# Altium schematic sheet EV2760-VT-00A.SchDoc: T-EV2760-V-03A
size A4; Organization: MPS; Revision: 03A; Checker: XXXX; Drawer: Alen Du; PageSetup: Record=PageOptions|CenterHorizontal=True|CenterVertical=True|PrintScale=1.00|XCorrection=1.00|YCorrection=1.00|PrintKind=0|BorderSize=5000000|LeftOffset=0|BottomOffset=0|Orientation=2|PaperLength=1000|PaperWidth=1000|Scale=100|PaperSource=15|PrintQuality=1200|MediaType=1|DitherType=10|PaperKind=A4|PrintScaleMode=1
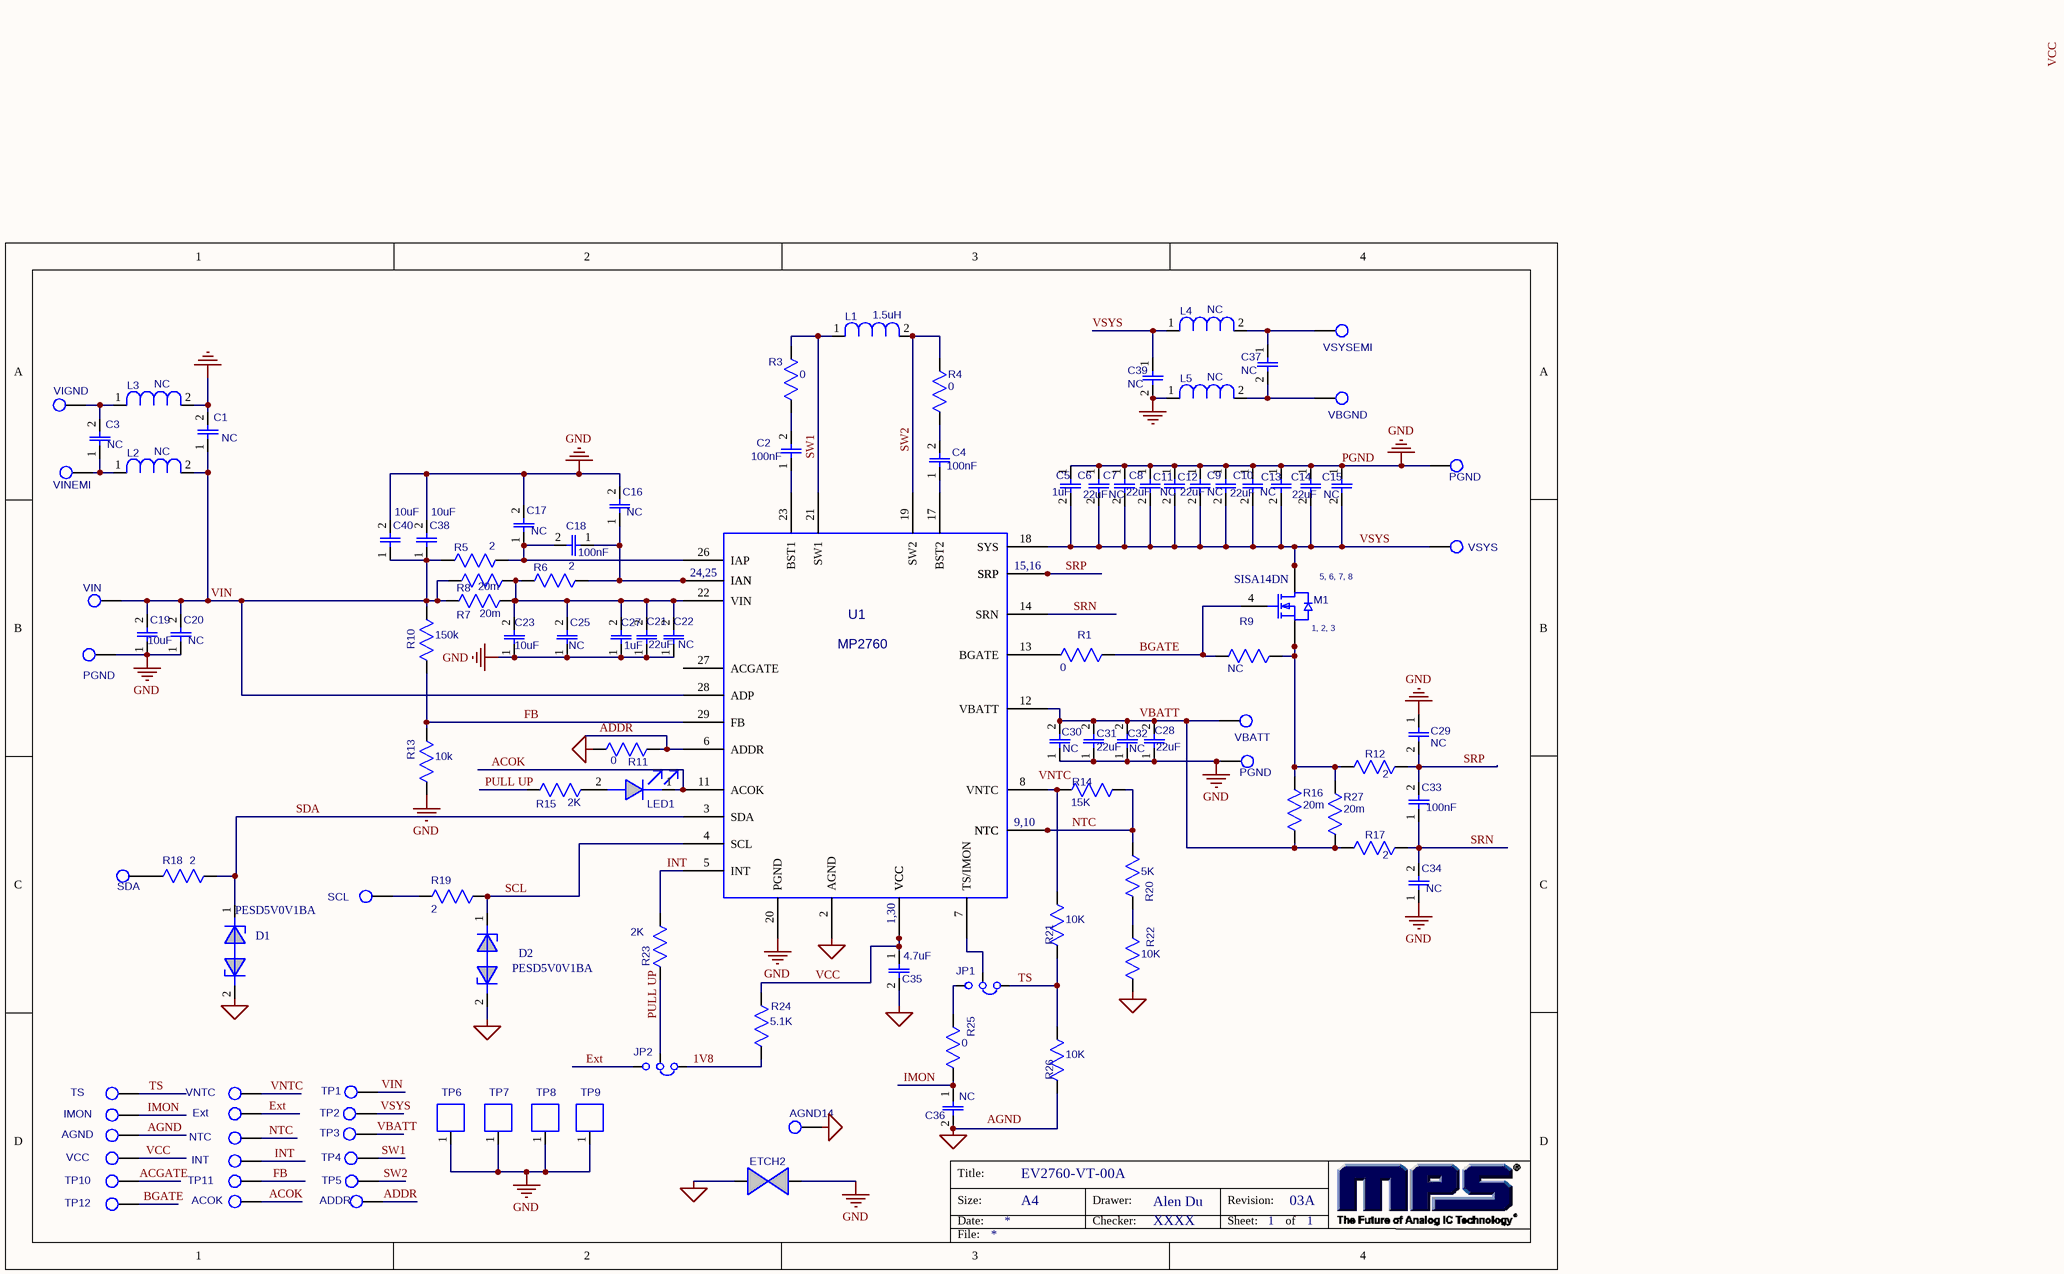
[diagram p0: EV2760-VT-00A.SchDoc]

## Parts
ACOK  {Package}  [CONN/TP]  (value not drawn)
ADDR  {Package}  [CONN/TP]  (value not drawn)
AGND  {Package}  [CONN/TP]  (value not drawn)
AGND14  {Package}  [CONN/TP]  (value not drawn)
C1  value NC  [CAP/0805]  (hidden comment: CAP/0603)
C2  value 100nF  [CAP/0603]  (hidden comment: CAP/0603)
C3  value NC  [CAP/0805]  (hidden comment: CAP/0603)
C4  value 100nF  [CAP/0603]  (hidden comment: CAP/0603)
C5  value 1uF  [CAP/0603]  (hidden comment: CAP/0402)
C6  value 22uF  [CAP/0805]  (hidden comment: CAP/0805)
C7  value NC  [CAP/0805]  (hidden comment: CAP/0805)
C8  value 22uF  [CAP/0805]  (hidden comment: CAP/0805)
C9  value NC  [CAP/0805]  (hidden comment: CAP/0805)
C10  value 22uF  [CAP/0805]  (hidden comment: CAP/0805)
C11  value NC  [CAP/0805]  (hidden comment: CAP/0805)
C12  value 22uF  [CAP/0805]  (hidden comment: CAP/0805)
C13  value NC  [CAP/0805]  (hidden comment: CAP/0805)
C14  value 22uF  [CAP/0805]  (hidden comment: 0805)
C15  value NC  [CAP/0603]  (hidden comment: CAP/0603)
C16  value NC  [CAP/0603]  (hidden comment: CAP/0603)
C17  value NC  [CAP/0603]  (hidden comment: CAP/0603)
C18  value 100nF  [CAP/0603]  (hidden comment: CAP/0603)
C19  value 10uF  [CAP/0805]  (hidden comment: CAP/0805)
C20  value NC  [CAP/0805]  (hidden comment: CAP/0805)
C21  value 22uF  [CAP/0603]  (hidden comment: CAP/0805)
C22  value NC  [CAP/0603]  (hidden comment: CAP/0603)
C23  value 10uF  [CAP/0805]  (hidden comment: CAP/0805)
C25  value NC  [CAP/0805]  (hidden comment: CAP/0805)
C27  value 1uF  [CAP/0603]  (hidden comment: CAP/0402)
C28  value 22uF  [CAP/0805]  (hidden comment: CAP/0805)
C29  value NC  [CAP/0603]  (hidden comment: CAP/0603)
C30  value NC  [CAP/0805]  (hidden comment: CAP/0805)
C31  value 22uF  [CAP/0805]  (hidden comment: CAP/0805)
C32  value NC  [CAP/0805]  (hidden comment: CAP/0805)
C33  value 100nF  [CAP/0603]  (hidden comment: CAP/0603)
C34  value NC  [CAP/0603]  (hidden comment: CAP/0603)
C35  value 4.7uF  [CAP/0603]  (hidden comment: CAP/0603)
C36  value NC  [CAP/0603]  (hidden comment: CAP/0603)
C37  value NC  [CAP/0603]  (hidden comment: CAP/0603)
C38  value 10uF  [CAP/0805]  (hidden comment: CAP/0805)
C39  value NC  [CAP/0603]  (hidden comment: CAP/0603)
C40  value 10uF  [CAP/0805]  (hidden comment: CAP/0805)
D1  PESD5V0V1BA  [SOD323/PESD5V0V1BA]
D2  PESD5V0V1BA  [SOD323/PESD5V0V1BA]
ETCH2  ETCH0402  [ETCH0603]  (value not drawn)
Ext  {Package}  [CONN/TP]  (value not drawn)
IMON  {Package}  [CONN/TP]  (value not drawn)
INT  {Package}  [CONN/TP]  (value not drawn)
JP1  JUMPER/3PIN/DIP/2.54MM/B  [CONN/DIP/3PIN/2.54MM/A]  (value not drawn)
JP2  JUMPER/3PIN/DIP/2.54MM/B  [CONN/DIP/3PIN/2.54MM/A]  (value not drawn)
L1  value 1.5uH  [IND/Wurth/7447745022]  (hidden comment: IND/TDK/SPM6530T-2R2M)
L2  value NC  [RES/0805]  (hidden comment: IND/TDK/SPM6530T-2R2M)
L3  value NC  [RES/0805]  (hidden comment: IND/TDK/SPM6530T-2R2M)
L4  value NC  [RES/0805]  (hidden comment: IND/TDK/SPM6530T-2R2M)
L5  value NC  [RES/0805]  (hidden comment: IND/TDK/SPM6530T-2R2M)
LED1  LED/SMD/0805  [LED/SMD/0805]  (value not drawn)
M1  SISA14DN  [MOS/POWERPAK/1212-8]
NTC  {Package}  [CONN/TP]  (value not drawn)
PGND1  PGND  [CONN/2MM]
PGND2  PGND  [CONN/2MM]
PGND3  PGND  [CONN/2MM]
R1  value 0  [RES/0603]  (hidden comment: RES/0603)
R3  value 0  [RES/0603]  (hidden comment: RES/0603)
R4  value 0  [RES/0603]  (hidden comment: RES/0603)
R5  value 2  [RES/0603]  (hidden comment: RES/0603)
R6  value 2  [RES/0603]  (hidden comment: RES/0603)
R7  value 20m  [RES/2512]  (hidden comment: RES/1206)
R8  value 20m  [RES/2512]  (hidden comment: RES/1206)
R9  value NC  [RES/0603]  (hidden comment: RES/0603)
R10  value 150k  [RES/0603]  (hidden comment: RES/0603)
R11  value 0  [RES/0603]  (hidden comment: RES/0603)
R12  value 2  [RES/0603]  (hidden comment: RES/0603)
R13  value 10k  [RES/0603]  (hidden comment: RES/0603)
R14  value 15K  [RES/0603]  (hidden comment: RES/0603)
R15  value 2K  [RES/0603]  (hidden comment: RES/0603)
R16  value 20m  [RES/1206]  (hidden comment: RES/2512)
R17  value 2  [RES/0603]  (hidden comment: RES/0603)
R18  value 2  [RES/0603]  (hidden comment: RES/0603)
R19  value 2  [RES/0603]  (hidden comment: RES/0603)
R20  value 5K  [RES/0603]  (hidden comment: RES/0603)
R21  value 10K  [RES/0603]  (hidden comment: RES/0603)
R22  value 10K  [RES/0603]  (hidden comment: RES/0603)
R23  value 2K  [RES/0603]  (hidden comment: RES/0603)
R24  value 5.1K  [RES/0603]  (hidden comment: RES/0603)
R25  value 0  [RES/0603]  (hidden comment: RES/0603)
R26  value 10K  [RES/0603]  (hidden comment: RES/0603)
R27  value 20m  [RES/1206]  (hidden comment: RES/2512)
SCL  SCL  [CONN/TP]
SDA  SDA  [CONN/TP]
TP1  {Package}  [CONN/TP]  (value not drawn)
TP2  {Package}  [CONN/TP]  (value not drawn)
TP3  {Package}  [CONN/TP]  (value not drawn)
TP4  {Package}  [CONN/TP]  (value not drawn)
TP5  {Package}  [CONN/TP]  (value not drawn)
TP6  接地测试点  [TP - GND]  (value not drawn)
TP7  接地测试点  [TP - GND]  (value not drawn)
TP8  接地测试点  [TP - GND]  (value not drawn)
TP9  接地测试点  [TP - GND]  (value not drawn)
TP10  {Package}  [CONN/TP]  (value not drawn)
TP11  {Package}  [CONN/TP]  (value not drawn)
TP12  {Package}  [CONN/TP]  (value not drawn)
TS  {Package}  [CONN/TP]  (value not drawn)
U1  MP2760  [FCQFN30L/4*5MM]
VBATT  VBATT  [CONN/2MM]
VBEMI  VSYSEMI  [CONN/2MM]
VBGND  VBGND  [CONN/2MM]
VCC  {Package}  [CONN/TP]  (value not drawn)
VIEMI  VINEMI  [CONN/2MM]
VIGND  VINGND  [CONN/2MM]  (value not drawn)
VIN2  VIN  [CONN/2MM]
VNTC  {Package}  [CONN/TP]  (value not drawn)
VSYS1  VSYS  [CONN/2MM]

## Nets
AGND: AGND.1 AGND14.1 C35.2 C36.2 D1.2 D2.2 ETCH2.1 R11.1 R22.1 R26.2 U1.2(AGND)
PGND: C1.2 C5.1 C6.1 C7.1 C8.1 C9.1 C10.1 C11.1 C12.1 C13.1 C14.1 C15.1 C16.2 C17.2 C19.1 C20.1 C21.1 C22.1 C23.1 C25.1 C27.1 C28.1 C29.1 C30.1 C31.1 C32.1 C34.1 C38.2 C39.2 C40.2 ETCH2.2 L3.2 L5.1 PGND1.1 PGND2.1 PGND3.1 R13.1 TP6.1 TP7.1 TP8.1 TP9.1 U1.20(PGND)  [also labelled GND]
1V8: JP2.1 R24.1
ACGATE: TP10.1
ACOK: ACOK.1 LED1.1 U1.11(ACOK)
ADDR: ADDR.1 R11.2 U1.6(ADDR)
BGATE: M1.4(G) R1.2 R9.1 TP12.1
Ext: Ext.1 JP2.3
FB: R10.1 R13.2 TP11.1 U1.29(FB)
IMON: C36.1 IMON.1 R25.1
INT: INT.1 R23.1 U1.5(INT)
NTC: NTC.1 R14.1 R20.2 U1.9(NTC) U1.10(NTC)
PULL UP: JP2.2 R15.1 R23.2
SCL: D2.1 R19.2 U1.4(SCL)
SDA: D1.1 R18.1 U1.3(SDA)
SRN: C33.1 C34.2 R17.2 U1.14(SRN)
SRP: C29.2 C33.2 R12.2 U1.15(SRP) U1.16(SRP)
SW1: L1.1 R3.2 TP4.1 U1.21(SW1)
SW2: L1.2 R4.1 TP5.1 U1.19(SW2)
TS: JP1.1 R21.2 R26.1 TS.1
VBATT: C28.2 C30.2 C31.2 C32.2 R16.1 R17.1 R27.1 TP3.1 U1.12(VBATT) VBATT.1
VCC: C35.1 R24.2 U1.1(VCC) U1.30(VCC) VCC.1
VIN: C1.1 C19.2 C20.2 C38.1 C40.1 L2.2 R5.1 R7.1 R8.1 R10.2 TP1.1 U1.28(ADP) VIN2.1
VNTC: VNTC.1
VSYS: C5.2 C6.2 C7.2 C8.2 C9.2 C10.2 C11.2 C12.2 C13.2 C14.2 C15.2 C39.1 L4.1 M1.5(D) M1.6(D) M1.7(D) M1.8(D) TP2.1 U1.18(SYS) VSYS1.1
NetC2_1: C2.1 U1.23(BST1)
NetC2_2: C2.2 R3.1
NetC3_1: C3.1 L2.1 VIEMI.1
NetC3_2: C3.2 L3.1 VIGND.1
NetC4_1: C4.1 U1.17(BST2)
NetC4_2: C4.2 R4.2
NetC16_1: C16.1 C18.1 R6.2 U1.24(IAN) U1.25(IAN)
NetC17_1: C17.1 C18.2 R5.2 U1.26(IAP)
NetC21_2: C21.2 C22.2 C23.2 C25.2 C27.2 R6.1 R7.2 R8.2 U1.22(VIN)
NetC37_1: C37.1 L4.2 VBEMI.1
NetC37_2: C37.2 L5.2 VBGND.1
NetJP1_2: JP1.2 U1.7(TS/IMON)
NetJP1_3: JP1.3 R25.2
NetLED1_2: LED1.2 R15.2
NetM1_1: M1.1(S) M1.2(S) M1.3(S) R9.2 R12.1 R16.2 R27.2
NetR1_1: R1.1 U1.13(BGATE)
NetR14_2: R14.2 R21.1 U1.8(VNTC)
NetR18_2: R18.2 SDA.1
NetR19_1: R19.1 SCL.1
NetR20_1: R20.1 R22.2

Not connected (* = marked no-connect by the designer): U1 27(ACGATE)

## Notes on the sheet
- (near C36) Title:
- Size:
- Date:
- A4
- EV2760-VT-00A
- Drawer:
- Checker:
- Revision:
- Sheet:
- 1
- of
- File:
- Labels drawn without touching a wire or pin: AGND, VCC, VNTC
- (in symbol 09.0001) 5, 6, 7, 8; 1, 2, 3
- (in symbol MP2651GV) 15,16; 24,25; 9,10; 1,30

## Library data of the parts
ACOK ADDR AGND AGND14 Ext IMON INT NTC SCL SDA TP10-TP12 TS VCC VNTC = 17.0017: Connector;; Manufacturer P/N: {Manufacturer P/N}; Manufacturer: {Manufacturer}; Part_Name: 1*40 180度 2.54mm 排针; Manufacture: 电子市场; Manufacture_PN: 61304011121; Pid: 17; Out_Num: 0; Available_Num: 755; CName: Jiao Zhang; ReferenceGuide: 优选器件; Package: {Package}; Value: *; Part Number: 17.0017; Spec: Connector; Stock_Num: 755; Ctime: 2010/8/18 17:10:54; UPName: Jiao Zhang; UPtime: 2010/8/20 17:09:01
C1 C3 = 07.0970: Capacitor;25V;X5R; Manufacturer: {Manufacturer}; Manufacturer P/N: {Manufacturer P/N}; Part_Name: GRM21BR61E106KA73; Manufacture: 村田; Pid: 2393; Out_Num: 0; Available_Num: 2129; CName: Liny; Note: 10uF/25V; Package: 0603; Part Number: 07.0970; Spec: Capacitor; Manufacture_PN: GRM21BR61E106KA73; Stock_Num: 2129; Ctime: 2013/7/29 14:35:14; UPName: Liny; UPtime: 2013/7/29 14:35:14
C2 C4 = 07.0969: Capacitor;25V;X5R; Manufacturer: {Manufacturer}; Manufacturer P/N: {Manufacturer P/N}; Part_Name: GRM188R61E474KA12D; Manufacture: muRata; Pid: 2392; Out_Num: 0; Available_Num: 4220; CName: Liny; ReferenceGuide: 普通器件; Note: 470uF/25V; Package: 0603; Part Number: 07.0969; Spec: Capacitor; Manufacture_PN: GRM188R61E474KA12D; Stock_Num: 4220; Ctime: 2013/7/29 14:36:03; UPName: Liny; UPtime: 2013/7/29 14:36:03
C5 C14-C17 C21 C22 C27 C29 C33 C34 C37 C39 = 07.0042: Ceramic Capacitor;25V;X7R;0603;; Manufacturer: {Manufacturer}; Manufacturer P/N: {Manufacturer P/N}; Part_Name: GRM188R71E105KA12D; Manufacture: muRata; Pid: 1504; Out_Num: 220; Available_Num: 19815; Note: 1uF/25V; Part Number: 07.0042; Spec: Ceramic Capacitor; Manufacture_PN: GRM188R71E105KA12D; Stock_Num: 20035
  C5 C27: Package: 0402
  C14 C21: Package: 0805
  C15-C17 C22 C29 C33 C34 C37 C39: Package: 0603
C6-C10 C12 C13 C28 C31 C32 = 07.1006: Capacitor;25V;X5R; Manufacturer: {Manufacturer}; Manufacturer P/N: {Manufacturer P/N}; Part_Name: C2012X5R1E226M; Manufacture: TDK; Pid: 2430; Out_Num: 0; Available_Num: 858; CName: Liny; ReferenceGuide: 普通器件; Note: 22uF/25V; Package: 0805; Part Number: 07.1006; Spec: Capacitor; Manufacture_PN: C2012X5R1E226M; Stock_Num: 858; Ctime: 2014/5/14 11:19:49; UPName: Liny; UPtime: 2014/5/14 11:19:49
C11 = 07.1121: Capacitor;25V;X7R; Manufacturer: {Manufacturer}; Manufacturer P/N: {Manufacturer P/N}; Part_Name: GRM21BR71E475KA73L; Manufacture: muRata; Pid: 2545; Out_Num: 0; Available_Num: 3003; CName: Liny; ReferenceGuide: 普通器件; Note: 22uF/25V; Package: 0805; Part Number: 07.1121; Spec: Capacitor; Manufacture_PN: GRM21BR71E475KA73L; Stock_Num: 3003; Ctime: 2015/5/6 14:28:14; UPName: Liny; UPtime: 2015/5/6 14:28:14
C18 = 07.0074: Ceramic Capacitor;50V;C0G;0603;; Manufacturer: {Manufacturer}; Manufacturer P/N: {Manufacturer P/N}; Part_Name: GRM1885C1H101JA01D; Manufacture: muRata; Pid: 1536; Out_Num: 0; Available_Num: 5725; Note: 100pF/50V; Package: 0603; Part Number: 07.0074; Spec: Ceramic Capacitor; Manufacture_PN: GRM1885C1H101JA01D; Stock_Num: 5725
C19 C20 C23 C25 C38 C40 = 07.0970: Capacitor;25V;X5R; Manufacturer: {Manufacturer}; Manufacturer P/N: {Manufacturer P/N}; Part_Name: GRM21BR61E106KA73; Manufacture: 村田; Pid: 2393; Out_Num: 0; Available_Num: 2129; CName: Liny; ReferenceGuide: 普通器件; Note: 10uF/25V; Package: 0805; Part Number: 07.0970; Spec: Capacitor; Manufacture_PN: GRM21BR61E106KA73; Stock_Num: 2129; Ctime: 2013/7/29 14:35:14; UPName: Liny; UPtime: 2013/7/29 14:35:14
C30 = 07.1121: Capacitor;25V;X7R; Manufacturer: {Manufacturer}; Manufacturer P/N: {Manufacturer P/N}; Part_Name: GRM21BR71E475KA73L; Manufacture: muRata; Pid: 2545; Out_Num: 0; Available_Num: 3003; CName: Liny; ReferenceGuide: 普通器件; Note: 4.7uF/25V; Package: 0805; Part Number: 07.1121; Spec: Capacitor; Manufacture_PN: GRM21BR71E475KA73L; Stock_Num: 3003; Ctime: 2015/5/6 14:28:14; UPName: Liny; UPtime: 2015/5/6 14:28:14
C35 C36 = 07.0015: Ceramic Capacitor;50V;X7R;0603;; Manufacturer: {Manufacturer}; Manufacturer P/N: {Manufacturer P/N}; Part_Name: C1608X7R1H104K; Manufacture: TDK; Pid: 1477; Out_Num: 0; EPR_Note: TDK停止提供; Note: 0.1uF/50V; Package: 0603; Part Number: 07.0015; Spec: Ceramic Capacitor; Manufacture_PN: C1608X7R1H104K; Stock_Num: 0; Available_Num: 0
ETCH2 = ETCH0402: {Description}; Manufacturer P/N: {Manufacturer P/N}; Manufacturer: {Manufacturer}; Package: {Package}
JP1 JP2 = JUMPER/3PIN/DIP/2.54MM/B: {Description}; Manufacturer P/N: {Manufacturer P/N}; Manufacturer: {Manufacturer}; Package: {Package}; Value: *
L1 = 03.0616: Inductor;2.2uH;0.0173ohms;8.2A; Manufacturer: {Manufacturer}; Manufacturer P/N: {Manufacturer P/N}; Part Number: 03.0763; Manufacture: Wurtj; Manufacture_PN: 74437349015; Pid: 2373; Out_Num: 0; Available_Num: 719; CName: Liny; ReferenceGuide: 普通器件; Note: 1.5uH/14.5A; Package: SMD; Spec: Inductor; Part_Name: SPM6530T-2R2M; Stock_Num: 719; Ctime: 2014/6/24 11:22:07; UPName: Liny; UPtime: 2014/6/24 11:22:07
L2-L5 = 03.0616: Inductor;2.2uH;0.0173ohms;8.2A; Manufacturer: {Manufacturer}; Manufacturer P/N: {Manufacturer P/N}; Manufacture: TDK; Pid: 2373; Out_Num: 0; Available_Num: 719; CName: Liny; Note: 2.2uH/8.2A; Package: SMD; Part Number: 03.0616; Spec: Inductor; Part_Name: SPM6530T-2R2M; Manufacture_PN: SPM6530T-2R2M; Stock_Num: 719; Ctime: 2014/6/24 11:22:07; UPName: Liny; UPtime: 2014/6/24 11:22:07
LED1 = 19.0009: LED;绿色;; Manufacturer P/N: {Manufacturer P/N}; Manufacturer: {Manufacturer}; Part_Name: BL-HGE35A-AV-TRB; Manufacture: 佰鸿; Value: BL-HGE35A-TRB; Pid: 44; Out_Num: 0; Available_Num: 3237; CName: Jiao Zhang; ReferenceGuide: 普通器件; Package: 0805; Part Number: 19.0009; Spec: LED; Manufacture_PN: BL-HGE35A-AV-TRB; Stock_Num: 3237; Ctime: 2011/1/26 14:26:55; UPName: Jiao Zhang; UPtime: 2011/2/15 11:05:11
M1 = 09.0001: N-Channel Mosfet;30V;6.2;27; Manufacture: Vishay; Pid: 186; Out_Num: 0; CName: Yan Zhang; ReferenceGuide: 优选器件; Value: SISA14DN; Part Number: 09.0001; Spec: N-Channel Mosfet; Part_Name: SISA14DN; Package: PowerPAK SO-8; Manufacture_PN: SISA14DN; Stock_Num: 0; Available_Num: 0; Ctime: 2010/8/19 16:21:38; UPName: Yan Zhang; UPtime: 2010/8/19 16:21:38
PGND1-PGND3 VBATT VIN2 VSYS1 = 17.0025: Connector;; Manufacturer P/N: {Manufacturer P/N}; Manufacturer: {Manufacturer}; Part_Name: 2.0公针; Pid: 25; Out_Num: 1000; Available_Num: 34550; CName: Jiao Zhang; ReferenceGuide: 普通器件; Package: {Package}; Value: *; Part Number: 17.0025; Spec: Connector; Stock_Num: 35550; Ctime: 2010/5/24 14:17:26; UPName: Jiao Zhang; UPtime: 2010/8/18 16:36:42
R1 R9-R14 R17 R20 R22 R23 R25 = 06.0007: Film Resistor;5%;1/10W; Manufacturer: Yageo; Manufacturer P/N: 9C06031A1203FKHFT; Part_Name: CR0603JA0303G; Manufacture: LIZ; Pid: 2672; Out_Num: 270; Available_Num: 3214; Note: 30k; Distributor: Digikey; Package: 0603; Distributor P/N: 311-120KHCT-ND; Part Number: 06.0007; Spec: Film Resistor; Manufacture_PN: CR0603JA0303G; Stock_Num: 3484
R3-R6 = 06.1315: Resistor;1%; Manufacturer: Yageo; Manufacturer P/N: 9C06031A1203FKHFT; Part_Name: RC0603FR-070RL; Pid: 3952; Out_Num: 780; Available_Num: 35125; CName: dora zou; ReferenceGuide: 普通器件; Distributor: Digikey; Package: 0603; Distributor P/N: 311-120KHCT-ND; Part Number: 06.1315; Spec: Resistor; Manufacture: Yageo; Manufacture_PN: RC0603FR-070RL; Stock_Num: 35905; Ctime: 2015/12/11 10:01:35; UPName: dora zou; UPtime: 2015/12/11 10:01:35
R7 R8 = 06.0037: Film Resistor;1%;1W;; Manufacturer: Panasonic; Manufacturer P/N: ERJ-3EKF1004V; Part_Name: RL3264-6-R010-FN; Manufacture: CYNTEC; Pid: 2717; Out_Num: 0; Note: 10m/1%/1206; Distributor: Digikey; Package: 1206; Distributor P/N: P1.00MHCT-ND; Part Number: 06.0037; Spec: Film Resistor; Manufacture_PN: RL3264-6-R010-FN; Stock_Num: 0; Available_Num: 0
R15 = 06.0092: Film Resistor;1%;; Manufacturer: Yageo; Manufacturer P/N: 9C06031A1203FKHFT; Part_Name: RC0603FR-072KL; Pid: 2772; Out_Num: 0; Available_Num: 9988; Note: 2k/1%; Distributor: Digikey; Package: 0603; Distributor P/N: 311-120KHCT-ND; Part Number: 06.0092; Spec: Film Resistor; Manufacture: Yageo; Manufacture_PN: RC0603FR-072KL; Stock_Num: 9988
R16 R27 = 06.0037: Film Resistor;1%;1W;; Manufacturer: Panasonic; Manufacturer P/N: ERJ-3EKF1004V; Part_Name: RL3264-6-R010-FN; Manufacture: CYNTEC; Pid: 2717; Out_Num: 0; Note: 10m/1%/2512; Distributor: Digikey; Package: 2512; Distributor P/N: P1.00MHCT-ND; Part Number: 06.0037; Spec: Film Resistor; Manufacture_PN: RL3264-6-R010-FN; Stock_Num: 0; Available_Num: 0
R18 R19 = 06.0966: Film Resistor;1%; Manufacturer: Yageo; Manufacturer P/N: 9C06031A1203FKHFT; Part_Name: RC0603FR-072R2L; Pid: 3628; Out_Num: 0; Available_Num: 17270; Note: 2.2/1%; Distributor: Digikey; Package: 0603; Distributor P/N: 311-120KHCT-ND; Part Number: 06.0966; Spec: Film Resistor; Manufacture: Yageo; Manufacture_PN: RC0603FR-072R2L; Stock_Num: 17270
R21 R26 = 06.0007: Film Resistor;5%;1/10W; Manufacturer: Yageo; Manufacturer P/N: 9C06031A1203FKHFT; Part_Name: CR0603JA0303G; Manufacture: LIZ; Pid: 2672; Out_Num: 270; Available_Num: 3214; Note: 100k; Distributor: Digikey; Package: 0603; Distributor P/N: 311-120KHCT-ND; Part Number: 06.0007; Spec: Film Resistor; Manufacture_PN: CR0603JA0303G; Stock_Num: 3484
R24 = 06.0691: Film Resistor;1%;; Manufacturer: Yageo; Manufacturer P/N: 9C06031A1203FKHFT; Part_Name: RC0603FR-075K1L; Pid: 3353; Out_Num: 160; Available_Num: 9614; Note: 5.1k/1%; Distributor: Digikey; Package: 0603; Distributor P/N: 311-120KHCT-ND; Part Number: 06.0691; Spec: Film Resistor; Manufacture: Yageo; Manufacture_PN: RC0603FR-075K1L; Stock_Num: 9774
TP1-TP5 = 17.0024: Connector;; Manufacturer P/N: {Manufacturer P/N}; Manufacturer: {Manufacturer}; Part Number: 17.0266; Part_Name: 1.0公针; Pid: 24; Out_Num: 0; Available_Num: 17583; CName: Jiao Zhang; ReferenceGuide: 普通器件; Package: {Package}; Value: *; Spec: Connector; Stock_Num: 17583; Ctime: 2010/5/24 14:16:55; UPName: Jiao Zhang; UPtime: 2010/8/18 16:35:45
TP6-TP9 = 17.0006: Connector; Manufacturer P/N: {Manufacturer P/N}; Manufacturer: {Manufacturer}; Part Number: 17.0265; Part_Name: 白铜柱; Pid: 6; Out_Num: 0; EPR_Note: 5000颗/包; CName: Liny; ReferenceGuide: 普通器件; Package: {Package}; Value: *; Spec: Connector; Stock_Num: 0; Available_Num: 0; Ctime: 2011/6/16 16:41:45; UPName: Liny; UPtime: 2011/6/16 16:41:45
U1 = MP2651GV: {Description}; Manufacturer P/N: {Manufacturer P/N}; Manufacturer: {Manufacturer}; Package: {Package}; Value: *
VBEMI VBGND VIEMI VIGND = 17.0025: Connector;; Manufacturer P/N: {Manufacturer P/N}; Manufacturer: {Manufacturer}; Part_Name: 2.0公针; Pid: 25; Out_Num: 1000; Available_Num: 34550; CName: Jiao Zhang; Package: {Package}; Value: *; Part Number: 17.0025; Spec: Connector; Stock_Num: 35550; Ctime: 2010/5/24 14:17:26; UPName: Jiao Zhang; UPtime: 2010/8/18 16:36:42
D1 D2 = PESD5V0V1BA: Value: PESD5V0V1BA